# Altium schematic sheet Multiplexers.SchDoc
size A3
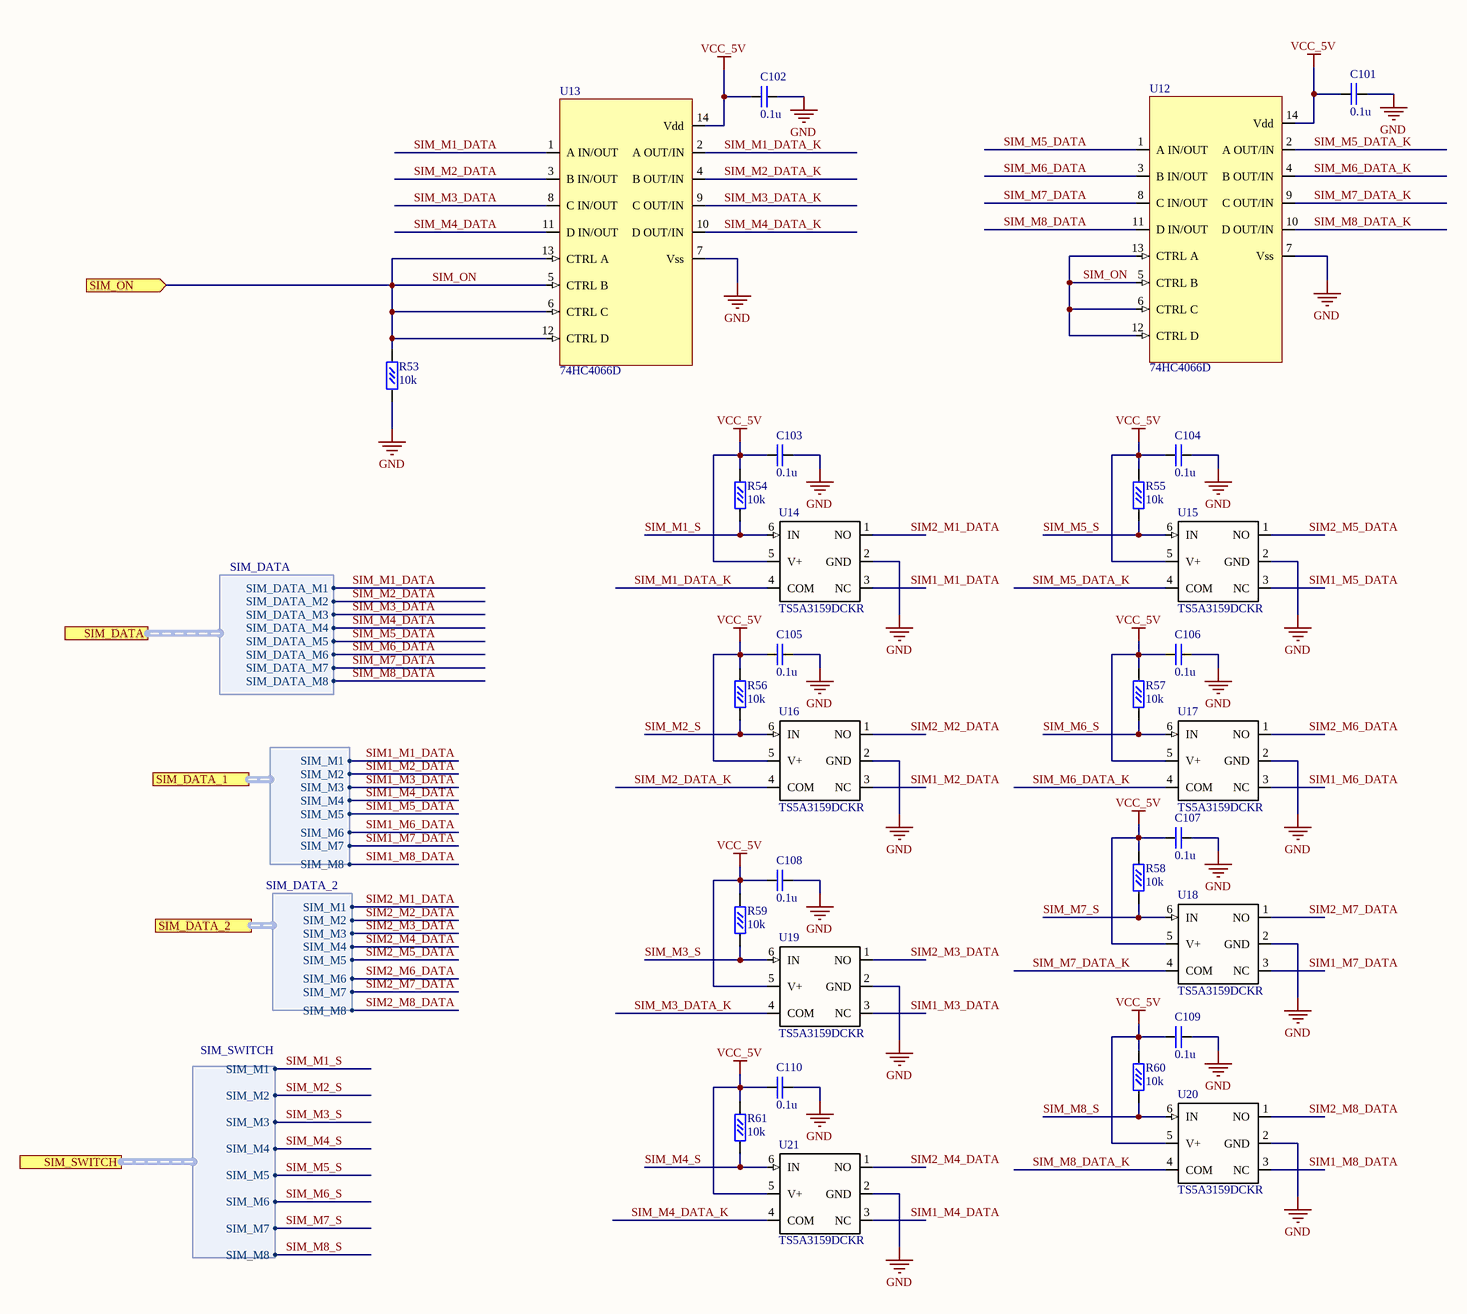
[diagram p0: Multiplexers.SchDoc]

## Parts
C101  value 0.1u  [C0402]  (hidden comment: Конденсатор SMD, 0.1мкФ, X7R, 16В, 10%, 0402)
C102  value 0.1u  [C0402]  (hidden comment: Конденсатор SMD, 0.1мкФ, X7R, 16В, 10%, 0402)
C103  value 0.1u  [C0402]  (hidden comment: Конденсатор SMD, 0.1мкФ, X5R, 25В, 10%, 0402)
C104  value 0.1u  [C0402]  (hidden comment: Конденсатор SMD, 0.1мкФ, X5R, 25В, 10%, 0402)
C105  value 0.1u  [C0402]  (hidden comment: Конденсатор SMD, 0.1мкФ, X5R, 25В, 10%, 0402)
C106  value 0.1u  [C0402]  (hidden comment: Конденсатор SMD, 0.1мкФ, X5R, 25В, 10%, 0402)
C107  value 0.1u  [C0402]  (hidden comment: Конденсатор SMD, 0.1мкФ, X5R, 25В, 10%, 0402)
C108  value 0.1u  [C0402]  (hidden comment: Конденсатор SMD, 0.1мкФ, X5R, 25В, 10%, 0402)
C109  value 0.1u  [C0402]  (hidden comment: Конденсатор SMD, 0.1мкФ, X5R, 25В, 10%, 0402)
C110  value 0.1u  [C0402]  (hidden comment: Конденсатор SMD, 0.1мкФ, X5R, 25В, 10%, 0402)
R53  value 10k  [R0603]  (hidden comment: Резистор SMD, 0.1Вт, 0603, 10кОм, 1%)
R54  value 10k  [R0603]  (hidden comment: Резистор SMD, 0.1Вт, 0603, 10кОм, 1%)
R55  value 10k  [R0603]  (hidden comment: Резистор SMD, 0.1Вт, 0603, 10кОм, 1%)
R56  value 10k  [R0603]  (hidden comment: Резистор SMD, 0.1Вт, 0603, 10кОм, 1%)
R57  value 10k  [R0603]  (hidden comment: Резистор SMD, 0.1Вт, 0603, 10кОм, 1%)
R58  value 10k  [R0603]  (hidden comment: Резистор SMD, 0.1Вт, 0603, 10кОм, 1%)
R59  value 10k  [R0603]  (hidden comment: Резистор SMD, 0.1Вт, 0603, 10кОм, 1%)
R60  value 10k  [R0603]  (hidden comment: Резистор SMD, 0.1Вт, 0603, 10кОм, 1%)
R61  value 10k  [R0603]  (hidden comment: Резистор SMD, 0.1Вт, 0603, 10кОм, 1%)
U12  74HC4066D  [14-SOIC]
U13  74HC4066D  [14-SOIC]
U14  PartNumber: TS5A3159DCKR  [SC70-6]  (hidden comment: TS5A3159)
U15  PartNumber: TS5A3159DCKR  [SC70-6]  (hidden comment: TS5A3159)
U16  PartNumber: TS5A3159DCKR  [SC70-6]  (hidden comment: TS5A3159)
U17  PartNumber: TS5A3159DCKR  [SC70-6]  (hidden comment: TS5A3159)
U18  PartNumber: TS5A3159DCKR  [SC70-6]  (hidden comment: TS5A3159)
U19  PartNumber: TS5A3159DCKR  [SC70-6]  (hidden comment: TS5A3159)
U20  PartNumber: TS5A3159DCKR  [SC70-6]  (hidden comment: TS5A3159)
U21  PartNumber: TS5A3159DCKR  [SC70-6]  (hidden comment: TS5A3159)

## Ports
SIM_DATA (harness SIM_DATA), SIM_DATA_1 (harness SIM_DATA_1), SIM_DATA_2 (harness SIM_DATA_2), SIM_ON (in), SIM_SWITCH (harness SIM_SWITCH)

## Harnesses
SIM_DATA: SIM_DATA_M1, SIM_DATA_M2, SIM_DATA_M3, SIM_DATA_M4, SIM_DATA_M5, SIM_DATA_M6, SIM_DATA_M7, SIM_DATA_M8
SIM_SWITCH: SIM_M1, SIM_M2, SIM_M3, SIM_M4, SIM_M5, SIM_M6, SIM_M7, SIM_M8
SIM_DATA_2: SIM_M1, SIM_M2, SIM_M3, SIM_M4, SIM_M5, SIM_M6, SIM_M7, SIM_M8
SIM_DATA_1: SIM_M1, SIM_M2, SIM_M3, SIM_M4, SIM_M5, SIM_M6, SIM_M7, SIM_M8

## Nets
GND: C101.2 C102.2 C103.2 C104.2 C105.2 C106.2 C107.2 C108.2 C109.2 C110.2 R53.1 U12.7(Vss) U13.7(Vss) U14.2(GND) U15.2(GND) U16.2(GND) U17.2(GND) U18.2(GND) U19.2(GND) U20.2(GND) U21.2(GND)
VCC_5V: C101.1 C102.1 C103.1 C104.1 C105.1 C106.1 C107.1 C108.1 C109.1 C110.1 R54.2 R55.2 R56.2 R57.2 R58.2 R59.2 R60.2 R61.2 U12.14(Vdd) U13.14(Vdd) U14.5(V+) U15.5(V+) U16.5(V+) U17.5(V+) U18.5(V+) U19.5(V+) U20.5(V+) U21.5(V+)
SIM1_M1_DATA: U14.3(NC) ; port SIM_DATA_1.SIM_M1
SIM1_M2_DATA: U16.3(NC) ; port SIM_DATA_1.SIM_M2
SIM1_M3_DATA: U19.3(NC) ; port SIM_DATA_1.SIM_M3
SIM1_M4_DATA: U21.3(NC) ; port SIM_DATA_1.SIM_M4
SIM1_M5_DATA: U15.3(NC) ; port SIM_DATA_1.SIM_M5
SIM1_M6_DATA: U17.3(NC) ; port SIM_DATA_1.SIM_M6
SIM1_M7_DATA: U18.3(NC) ; port SIM_DATA_1.SIM_M7
SIM1_M8_DATA: U20.3(NC) ; port SIM_DATA_1.SIM_M8
SIM2_M1_DATA: U14.1(NO) ; port SIM_DATA_2.SIM_M1
SIM2_M2_DATA: U16.1(NO) ; port SIM_DATA_2.SIM_M2
SIM2_M3_DATA: U19.1(NO) ; port SIM_DATA_2.SIM_M3
SIM2_M4_DATA: U21.1(NO) ; port SIM_DATA_2.SIM_M4
SIM2_M5_DATA: U15.1(NO) ; port SIM_DATA_2.SIM_M5
SIM2_M6_DATA: U17.1(NO) ; port SIM_DATA_2.SIM_M6
SIM2_M7_DATA: U18.1(NO) ; port SIM_DATA_2.SIM_M7
SIM2_M8_DATA: U20.1(NO) ; port SIM_DATA_2.SIM_M8
SIM_M1_DATA: U13.1(A_IN/OUT) ; port SIM_DATA.SIM_DATA_M1
SIM_M1_DATA_K: U13.2(A_OUT/IN) U14.4(COM)
SIM_M1_S: R54.1 U14.6(IN) ; port SIM_SWITCH.SIM_M1
SIM_M2_DATA: U13.3(B_IN/OUT) ; port SIM_DATA.SIM_DATA_M2
SIM_M2_DATA_K: U13.4(B_OUT/IN) U16.4(COM)
SIM_M2_S: R56.1 U16.6(IN) ; port SIM_SWITCH.SIM_M2
SIM_M3_DATA: U13.8(C_IN/OUT) ; port SIM_DATA.SIM_DATA_M3
SIM_M3_DATA_K: U13.9(C_OUT/IN) U19.4(COM)
SIM_M3_S: R59.1 U19.6(IN) ; port SIM_SWITCH.SIM_M3
SIM_M4_DATA: U13.11(D_IN/OUT) ; port SIM_DATA.SIM_DATA_M4
SIM_M4_DATA_K: U13.10(D_OUT/IN) U21.4(COM)
SIM_M4_S: R61.1 U21.6(IN) ; port SIM_SWITCH.SIM_M4
SIM_M5_DATA: U12.1(A_IN/OUT) ; port SIM_DATA.SIM_DATA_M5
SIM_M5_DATA_K: U12.2(A_OUT/IN) U15.4(COM)
SIM_M5_S: R55.1 U15.6(IN) ; port SIM_SWITCH.SIM_M5
SIM_M6_DATA: U12.3(B_IN/OUT) ; port SIM_DATA.SIM_DATA_M6
SIM_M6_DATA_K: U12.4(B_OUT/IN) U17.4(COM)
SIM_M6_S: R57.1 U17.6(IN) ; port SIM_SWITCH.SIM_M6
SIM_M7_DATA: U12.8(C_IN/OUT) ; port SIM_DATA.SIM_DATA_M7
SIM_M7_DATA_K: U12.9(C_OUT/IN) U18.4(COM)
SIM_M7_S: R58.1 U18.6(IN) ; port SIM_SWITCH.SIM_M7
SIM_M8_DATA: U12.11(D_IN/OUT) ; port SIM_DATA.SIM_DATA_M8
SIM_M8_DATA_K: U12.10(D_OUT/IN) U20.4(COM)
SIM_M8_S: R60.1 U20.6(IN) ; port SIM_SWITCH.SIM_M8
SIM_ON: R53.2 U12.5(CTRL_B) U12.6(CTRL_C) U12.12(CTRL_D) U12.13(CTRL_A) U13.5(CTRL_B) U13.6(CTRL_C) U13.12(CTRL_D) U13.13(CTRL_A) ; port SIM_ON

## Library data of the parts
C101 C102 = C0402: Chip Capacitor 0402; Assembly: 0.1u_X7R_16V_10%_0402; Voltage_assembly: 16V; Voltage: 16В; Tolerance: 10%; TemperatureCoeff: X7R; Family: Конденсатор SMD; Capacitance: 0.1мкФ; Package: 0402
C103-C110 = C0402: Chip Capacitor 0402; Assembly: 0.1u_X5R_25V_10%_0402; Voltage_assembly: 25V; Voltage: 25В; Tolerance: 10%; TemperatureCoeff: X5R; Family: Конденсатор SMD; Capacitance: 0.1мкФ; Package: 0402
R53-R61 = R0603_0.1: Chip Resistor 0603, 0.1 W; Assembly: 10k_0.1W_1%_0603; Power_assembly: 0.1W; Power: 0.1Вт; Tolerance: 1%; Family: Резистор SMD; Package: 0603; Resistance: 10кОм
U12 U13 = 74HC4066D: CMOS QUAD BILATERAL SWITCH; Manufacturer: Nexperia; Family: Микросхема; Package: SOIC-14; PartNumber: 74HC4066D
U14-U21 = TS5A3159: Analog SPDT Switch; Manufacturer: Texas Instruments; Family: Микросхема; Package: SC70-6